# EAGLE design Super-Regenerative-Receiver-1Transistor-ElektorSeptember2007 (EAGLE 7.2.0)
Elektor FM Broadcast Super-Regenerative Receiver Burkhard Kainka's super-regenerative FM receiver from Elektor September 2007. http://www.vk2zay.net/article/195 http://siva666siva.webs.com/FM.PDF
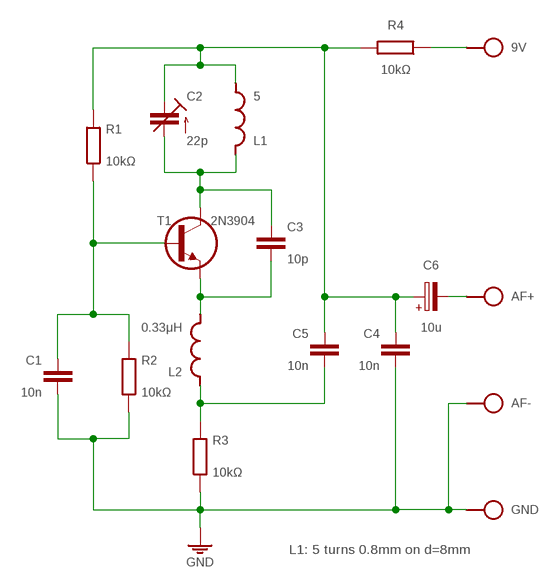
[diagram p0: schematic, sheet 1]

## Parts
9V  SPAD  [SPAD]
AF+  SPAD  [SPAD]
AF-  SPAD  [SPAD]
C1  10n  C050-020X036/V  [C050-020X036/V]
C2  22p  C-TR-PH20127  [TRIM-2222-808]
C3  10p  C050-020X036/V  [C050-020X036/V]
C4  10n  C050-020X036/V  [C050-020X036/V]
C5  10n  C050-020X036/V  [C050-020X036/V]
C6  10u  CPOLE2,5-3  [E2,5-3]
GND  SPAD  [SPAD]
L1  5  L-SHORTL-04-5/5V-X  [L-04-5/5V-X]
L2  0.33μH  L-SHORT02/7V  [L-02/7V]
R1  10kΩ  R0204/10  [0204/10]
R2  10kΩ  R0204/10  [0204/10]
R3  10kΩ  R0204/10  [0204/10]
R4  10kΩ  R0204/7  [0204/7]
T1  2N3904  [TO92]

## Nets
GND: AF-.1 C1.2 C4.2 GND.1 R2.1 R3.1
N$1: C1.1 R1.1 R2.2 T1.2(B)
N$2: AF+.1 C6.-
N$3: C5.2 L2.2 R3.2
N$4: C3.2 L2.1 T1.1(E)
N$6: C2.2(A) C3.1 L1.2 T1.3(C)
N$7: 9V.1 R4.1
N$8: C2.1(E) C2.3(E) C4.1 C5.1 C6.+ L1.1 R1.2 R4.2

## Notes on the sheet
- L1: 5 turns 0.8mm on d=8mm

## Library data of the parts
9V AF+ AF- GND = pad:SPAD
C1 C3-C5 = c:C: CAPACITOR, European symbol
C2 = cap-trim:C-TR-PH20127
C6 = c:CPOL: POLARIZED CAPACITOR, European symbol
L1 L2 = l:L-SHORT
R1-R4 = r:R: RESISTOR, European symbol
T1 = t:2N3904

## Board
Elektor FM Broadcast Super-Regenerative Receiver Burkhard Kainka's super-regenerative FM receiver from Elektor September 2007. http://www.vk2zay.net/article/195 http://siva666siva.webs.com/FM.PDF
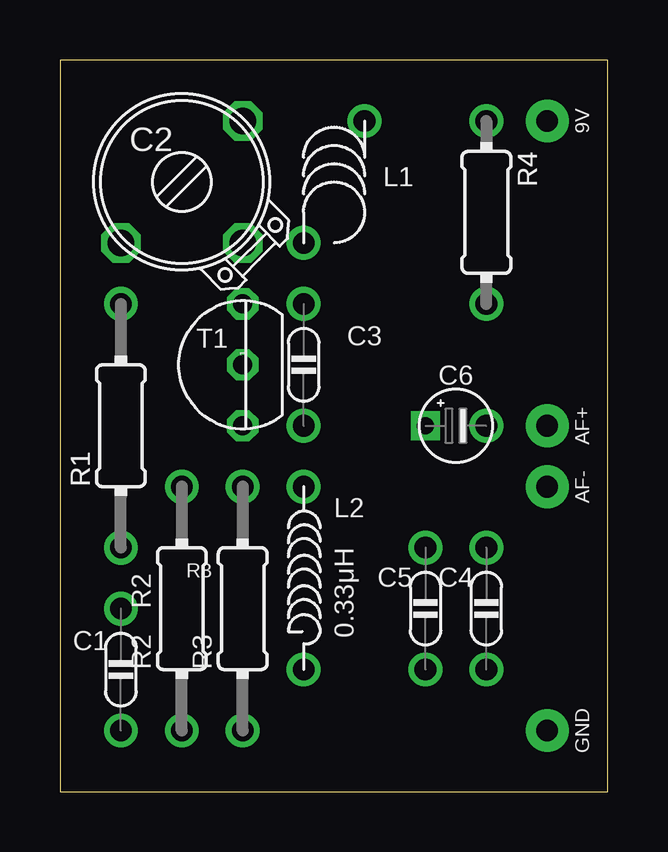
[diagram p1: board, top side]
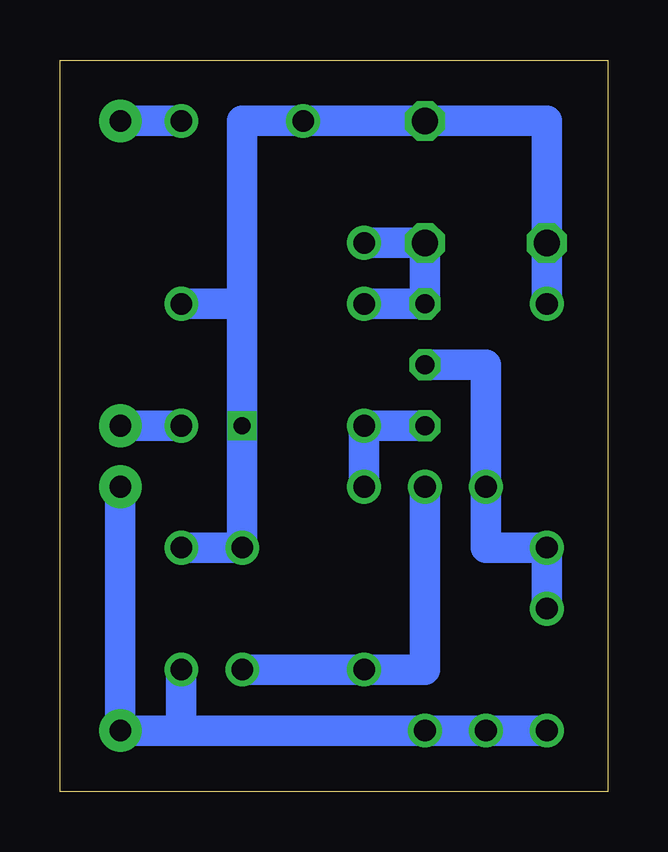
[diagram p2: board, bottom side, seen from below]

Size 22.84 x 30.48 mm. Coordinates in mm from the lower left corner, seen from the top.
Outline: 0,0 22.84,0 22.84,30.48 0,30.48 0,0
Copper layers (1*16): Top 0.035mm / dielectric 1.5mm / Bottom 0.035mm
Design rules "default": minimum track width 10mil, minimum drill 24mil, track to track 8mil, track to pad 8mil, pad to pad 8mil, via to via 8mil, smd to smd 8mil, copper to edge 40mil, drill to drill 8mil, minimum pad ring 10mil, minimum via ring 8mil, stop-mask expansion 4mil, vias tented up to drill 0mil, thermal gap 10mil

### Footprints (pad centres in the part's own frame; a part is rotated, then mirrored left to right if it is on the bottom)
SPAD = drill 0.9 pad 1.778: 1 0,0
C050-020X036/V = drill 0.9: 1 0,-2.54; 2 0,2.54
TRIM-2222-808 = drill 1.1 octagon: 1 -2.54,2.54; 2 -2.54,-2.54; 3 2.54,-2.54
E2,5-3 = drill 0.7 square: + 0,1.27 | drill 0.9: - 0,-1.27
L-04-5/5V-X = drill 0.9: 1 1.27,2.54; 2 -1.27,-2.54
L-02/7V = drill 0.9: 1 0,3.81; 2 0,-3.81
0204/10 = drill 0.9: 1 -5.08,0; 2 5.08,0
0204/7 = drill 0.9: 1 -3.81,0; 2 3.81,0
TO92 = drill 0.8 octagon: 1 -2.54,0; 2 0,0; 3 2.54,0

### Placement (x,y rotation side)
9V  20.32,27.94 180 top
AF+  20.32,15.24 180 top
AF-  20.32,12.7 180 top
C1  2.54,5.08 180 top
C2  5.08,25.4 90 top
C3  10.16,17.78 180 top
C4  17.78,7.62 180 top
C5  15.24,7.62 180 top
C6  16.51,15.24 90 top
GND  20.32,2.54 180 top
L1  11.43,25.4 0 top
L2  10.16,8.89 0 top
R1  2.54,15.24 90 top
R2  5.08,7.62 90 top
R3  7.62,7.62 90 top
R4  17.78,24.13 270 top
T1  7.62,17.78 90 top

### Tracks (layer width: path | path; a pad name or v marks a point on that pad's centre or on a via)
GND
  Bottom 1.27: C1.2 R2.1 R3.1 17.78,2.54 | 17.78,2.54 C4.2 | 17.78,2.54 GND.1 AF-.1
N$1
  Bottom 1.27: T1.2 5.08,17.78 R2.2 5.08,10.16 R1.1 C1.1
N$2
  Bottom 1.27: C6.- AF+.1
N$3
  Bottom 1.27: R3.2 7.62,5.08 L2.2 C5.2
N$4
  Bottom 1.27: T1.1 C3.2 L2.1
N$6
  Bottom 1.27: C3.1 T1.3 C2.2 L1.2
N$7
  Bottom 1.27: 9V.1 R4.1
N$8
  Bottom 1.27: R1.2 C2.1 2.54,27.94 C2.3 L1.1 15.24,27.94 15.24,20.32 | C4.1 C5.1 C6.+ 15.24,20.32 | R4.2 15.24,20.32

### Text on the board
Measures: 11 | 10 | 9 | 8 | 7 | 6 | 5 | 4 | 3 | 2 | 1 | 1 | 2 | 3 | 4 | 5 | 6 | 7 | 8